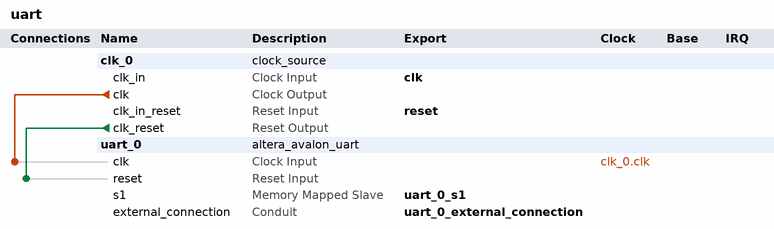
[diagram p0: system contents]
# Platform Designer (Qsys) system uart, Cyclone IV E EP4CE22F17C6
# Parameters at their usual value, and those the tool derives, are not listed.
package require -exact qsys 18.1
create_system uart
set_project_property DEVICE_FAMILY {Cyclone IV E}
set_project_property DEVICE EP4CE22F17C6

add_instance clk_0 clock_source 18.1
set_instance_parameter_value clk_0 clockFrequency 50000000

add_instance uart_0 altera_avalon_uart 18.1
set_instance_parameter_value uart_0 baud 9600
set_instance_parameter_value uart_0 dataBits 8
set_instance_parameter_value uart_0 fixedBaud true
set_instance_parameter_value uart_0 parity NONE
set_instance_parameter_value uart_0 stopBits 1

# connections
add_connection clk_0.clk uart_0.clk clock
add_connection clk_0.clk_reset uart_0.reset reset

# exported interfaces
add_interface clk clock sink
set_interface_property clk EXPORT_OF clk_0.clk_in
add_interface reset reset sink
set_interface_property reset EXPORT_OF clk_0.clk_in_reset
add_interface uart_0_external_connection conduit end
set_interface_property uart_0_external_connection EXPORT_OF uart_0.external_connection
add_interface uart_0_s1 avalon slave
set_interface_property uart_0_s1 EXPORT_OF uart_0.s1

set_interconnect_requirement {$system} qsys_mm.clockCrossingAdapter HANDSHAKE
set_interconnect_requirement {$system} qsys_mm.insertDefaultSlave false
set_interconnect_requirement {$system} qsys_mm.maxAdditionalLatency 1

save_system uart.qsys
